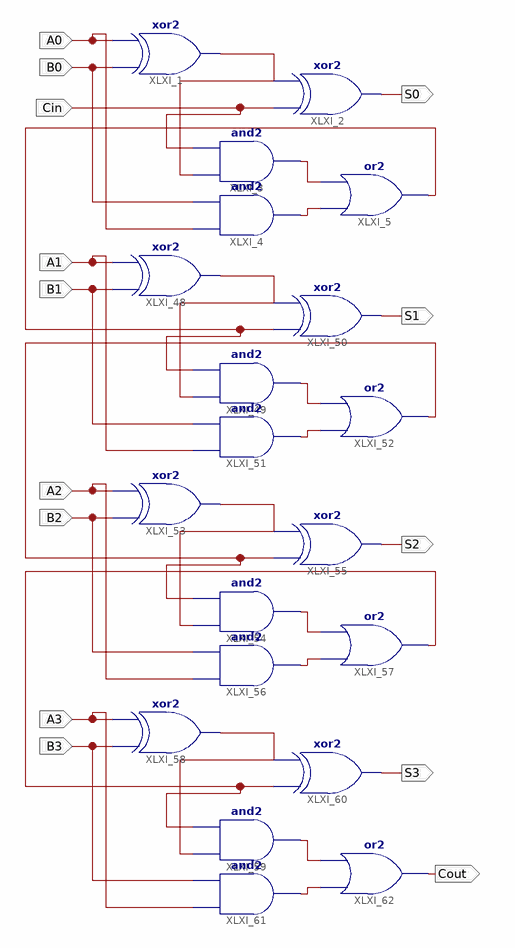
[diagram p0: schematic sheet 1]
// Xilinx ISE schematic full_adder.sch (spartan3e) as structural Verilog: 20 symbols, 14 ports
module full_adder (
  input  A0,
  input  Cin,
  input  B0,
  input  A1,
  input  B1,
  input  A2,
  input  B2,
  input  A3,
  input  B3,
  output S0,
  output S1,
  output S2,
  output S3,
  output Cout
);

  wire Cout0, XLXN_1, XLXN_9, XLXN_10, XLXN_110, XLXN_111, XLXN_113, XLXN_116, XLXN_121, XLXN_122, XLXN_124,
       XLXN_127, XLXN_132, XLXN_133, XLXN_135;

  xor XLXI_1 (XLXN_1, B0, A0);
  xor XLXI_2 (S0, Cin, XLXN_1);
  and XLXI_3 (XLXN_9, XLXN_1, Cin);
  and XLXI_4 (XLXN_10, A0, B0);
  or XLXI_5 (Cout0, XLXN_10, XLXN_9);
  xor XLXI_48 (XLXN_110, B1, A1);
  and XLXI_49 (XLXN_111, XLXN_110, Cout0);
  xor XLXI_50 (S1, Cout0, XLXN_110);
  and XLXI_51 (XLXN_113, A1, B1);
  or XLXI_52 (XLXN_116, XLXN_113, XLXN_111);
  xor XLXI_53 (XLXN_121, B2, A2);
  and XLXI_54 (XLXN_122, XLXN_121, XLXN_116);
  xor XLXI_55 (S2, XLXN_116, XLXN_121);
  and XLXI_56 (XLXN_124, A2, B2);
  or XLXI_57 (XLXN_127, XLXN_124, XLXN_122);
  xor XLXI_58 (XLXN_132, B3, A3);
  and XLXI_59 (XLXN_133, XLXN_132, XLXN_127);
  xor XLXI_60 (S3, XLXN_127, XLXN_132);
  and XLXI_61 (XLXN_135, A3, B3);
  or XLXI_62 (Cout, XLXN_135, XLXN_133);
endmodule
